# EAGLE design main1 (EAGLE 9.0.1)
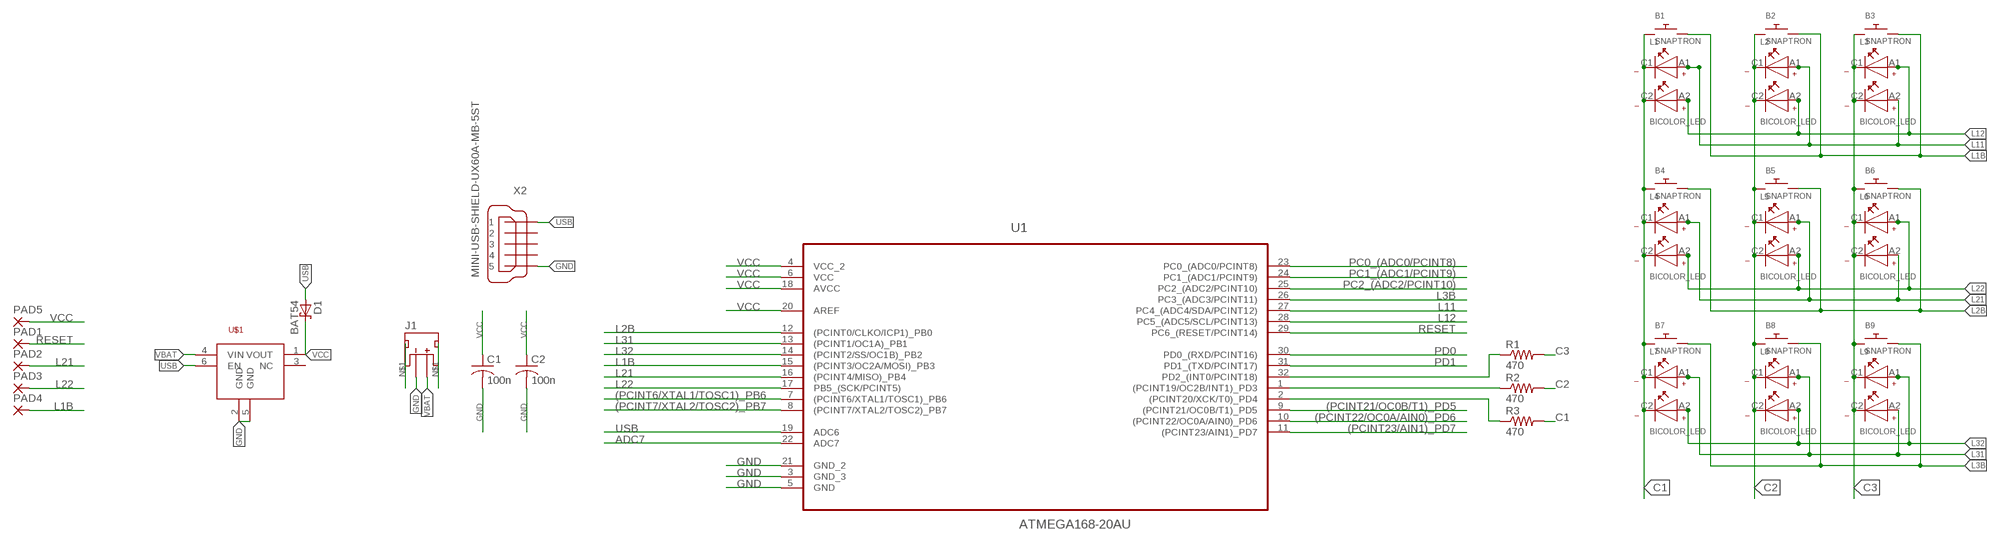
[diagram p0: schematic, sheet 1]

## Parts
B1  SNAPTRON  [SNAPTRON-8.5]
B2  SNAPTRON  [SNAPTRON-8.5]
B3  SNAPTRON  [SNAPTRON-8.5]
B4  SNAPTRON  [SNAPTRON-8.5]
B5  SNAPTRON  [SNAPTRON-8.5]
B6  SNAPTRON  [SNAPTRON-8.5]
B7  SNAPTRON  [SNAPTRON-8.5]
B8  SNAPTRON  [SNAPTRON-8.5]
B9  SNAPTRON  [SNAPTRON-8.5]
C1  100n  C-USC0603  [C0603]
C2  100n  C-USC0603  [C0603]
D1  BAT54  [SOT23]
J1  JST_2MM_MALE  [JST-2-SMD]
L1  BICOLOR_LED  [BICOLOR_LED]
L2  BICOLOR_LED  [BICOLOR_LED]
L3  BICOLOR_LED  [BICOLOR_LED]
L4  BICOLOR_LED  [BICOLOR_LED]
L5  BICOLOR_LED  [BICOLOR_LED]
L6  BICOLOR_LED  [BICOLOR_LED]
L7  BICOLOR_LED  [BICOLOR_LED]
L8  BICOLOR_LED  [BICOLOR_LED]
L9  BICOLOR_LED  [BICOLOR_LED]
PAD1  SMD2  [SMD1,27-2,54]
PAD2  SMD5  [SMD2,54-5,08]
PAD3  SMD5  [SMD2,54-5,08]
PAD4  SMD5  [SMD2,54-5,08]
PAD5  SMD2  [SMD1,27-2,54]
R1  470  R-US_R0603  [R0603]
R2  470  R-US_R0603  [R0603]
R3  470  R-US_R0603  [R0603]
U1  ATMEGA168-20AU  [QFP80P900X900X120-32N]
U$1  MIC94090  [SC70-6L]
X2  MINI-USB-SHIELD-UX60A-MB-5ST  [UX60A-MB-5ST]

## Nets
(PCINT6/XTAL1/TOSC1)_PB6: U1.7((PCINT6/XTAL1/TOSC1)_PB6)
(PCINT7/XTAL2/TOSC2)_PB7: U1.8((PCINT7/XTAL2/TOSC2)_PB7)
(PCINT21/OC0B/T1)_PD5: U1.9((PCINT21/OC0B/T1)_PD5)
(PCINT22/OC0A/AIN0)_PD6: U1.10((PCINT22/OC0A/AIN0)_PD6)
(PCINT23/AIN1)_PD7: U1.11((PCINT23/AIN1)_PD7)
ADC7: U1.22(ADC7)
C1: B1.P$1 B4.P$1 B7.P$1 L1.C1 L1.C2 L4.C1 L4.C2 L7.C1 L7.C2 R3.2
C2: B2.P$1 B5.P$1 B8.P$1 L2.C1 L2.C2 L5.C1 L5.C2 L8.C1 L8.C2 R2.2
C3: B3.P$1 B6.P$1 B9.P$1 L3.C1 L3.C2 L6.C1 L6.C2 L9.C1 L9.C2 R1.2
GND: C1.2 C2.2 J1.1(-) U1.3(GND_3) U1.5(GND) U1.21(GND_2) U$1.2(GND) U$1.5(GND) X2.5
L1B: B1.P$2 B2.P$2 B3.P$2 PAD4.1(P) U1.15((PCINT3/OC2A/MOSI)_PB3)
L2B: B4.P$2 B5.P$2 B6.P$2 U1.12((PCINT0/CLKO/ICP1)_PB0)
L3B: B7.P$2 B8.P$2 B9.P$2 U1.26(PC3_(ADC3/PCINT11))
L11: L1.A1 L2.A1 L3.A2 U1.27(PC4_(ADC4/SDA/PCINT12))
L12: L1.A2 L2.A2 L3.A1 U1.28(PC5_(ADC5/SCL/PCINT13))
L21: L4.A1 L5.A1 L6.A2 PAD2.1(P) U1.16((PCINT4/MISO)_PB4)
L22: L4.A2 L5.A2 L6.A1 PAD3.1(P) U1.17(PB5_(SCK/PCINT5))
L31: L7.A1 L8.A1 L9.A2 U1.13((PCINT1/OC1A)_PB1)
L32: L7.A2 L8.A2 L9.A1 U1.14((PCINT2/SS/OC1B)_PB2)
N$1: J1.NC1(PAD1) J1.NC2(PAD2)
N$2: R2.1 U1.1((PCINT19/OC2B/INT1)_PD3)
N$5: R3.1 U1.2((PCINT20/XCK/T0)_PD4)
N$25: R1.1 U1.32(PD2_(INT0/PCINT18))
PC0_(ADC0/PCINT8): U1.23(PC0_(ADC0/PCINT8))
PC1_(ADC1/PCINT9): U1.24(PC1_(ADC1/PCINT9))
PC2_(ADC2/PCINT10): U1.25(PC2_(ADC2/PCINT10))
PD0: U1.30(PD0_(RXD/PCINT16))
PD1: U1.31(PD1_(TXD/PCINT17))
RESET: PAD1.1(P) U1.29(PC6_(RESET/PCINT14))
USB: D1.1(A) U1.19(ADC6) U$1.6(EN) X2.1
VBAT: J1.2(+) U$1.4(VIN)
VCC: C1.1 C2.1 D1.3(C) PAD5.1(P) U1.4(VCC_2) U1.6(VCC) U1.18(AVCC) U1.20(AREF) U$1.1(VOUT)
Unconnected: U$1.3(NC) X2.2 X2.3 X2.4 X2.M1(S1) X2.M2(S2) X2.M3(S3) X2.M4(S4)

## Library data of the parts
B1-B9 = 7_segment_lib:SNAPTRON
C1 C2 = rcl:C-US: CAPACITOR, American symbol; SPICEPREFIX: C
D1 = diode:BAT54: Schottky Diodes Source: Fairchild .. BAT54.pdf
J1 = SparkFun-Connectors:JST_2MM_MALE: JST 2MM MALE RA CONNECTOR Two pin, compact surface mount connector. Commonly used as a battery input connection point. We really like the solid locking feeling and high current rating on these small connectors. We use these all the time as battery connectors. Mates to single-cell LiPo batteries. Here is the connector we sell at SparkFun: JST Right Angle Connector - White <https://www.sparkfun.com/products/8612> (PRT-08612) Datasheet <http://www.sparkfun.com/datasheets/Prototyping/Connectors/JST-Horizontal.pdf> It was used on these SparkFun products: SparkFun MOSFET Power Controller <https://www.sparkfun.com/products/11214> (PRT-11214) SparkFun Battery Babysitter - LiPo Battery Manager <https://www.sparkfun.com/products/13777> (PRT-13777) And many, many others that required a lipo battery connection.; PROD_ID: CONN-11443; SF_ID: PRT-08612
L1-L9 = 7_segment_lib:BICOLOR_LED
PAD1 PAD5 = wirepad:SMD2: SMD PAD
PAD2-PAD4 = wirepad:SMD5: SMD PAD
R1-R3 = rcl:R-US_: RESISTOR, American symbol; SPICEPREFIX: R
U1 = Atmel_By_element14_Batch_1-00:ATMEGA168-20AU: Microcontroller; DESCRIPTION: Microcontroller; MPN: ATMEGA168-20AU; OC_FARNELL: 9171193; OC_NEWARK: 01M6891; PACKAGE: QFP-32; SUPPLIER: ATMEL
U$1 = 7_segment_lib:MIC94090
X2 = con-hirose:MINI-USB-SHIELD-: MINI USB Connector Source: http://www.hirose.co.jp/cataloge_hp/e24000019.pdf; OC_FARNELL: unknown; OC_NEWARK: unknown

## Board
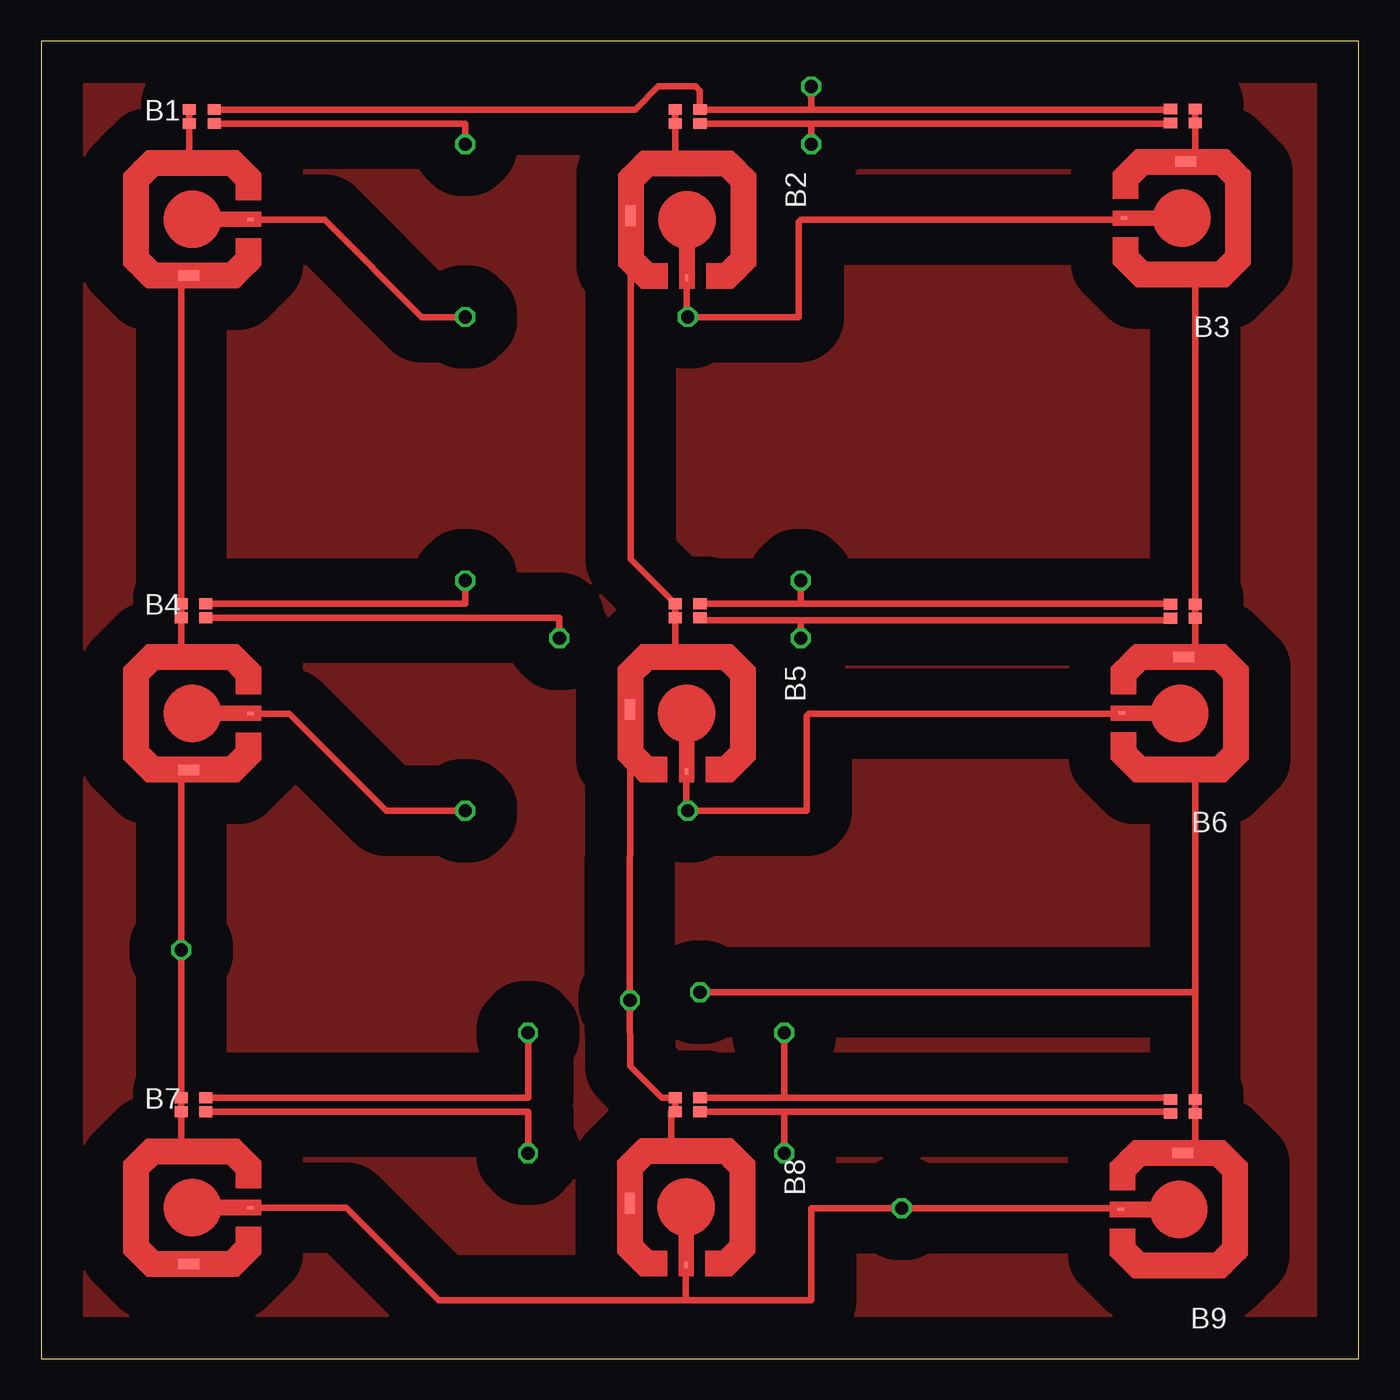
[diagram p1: board, top side]
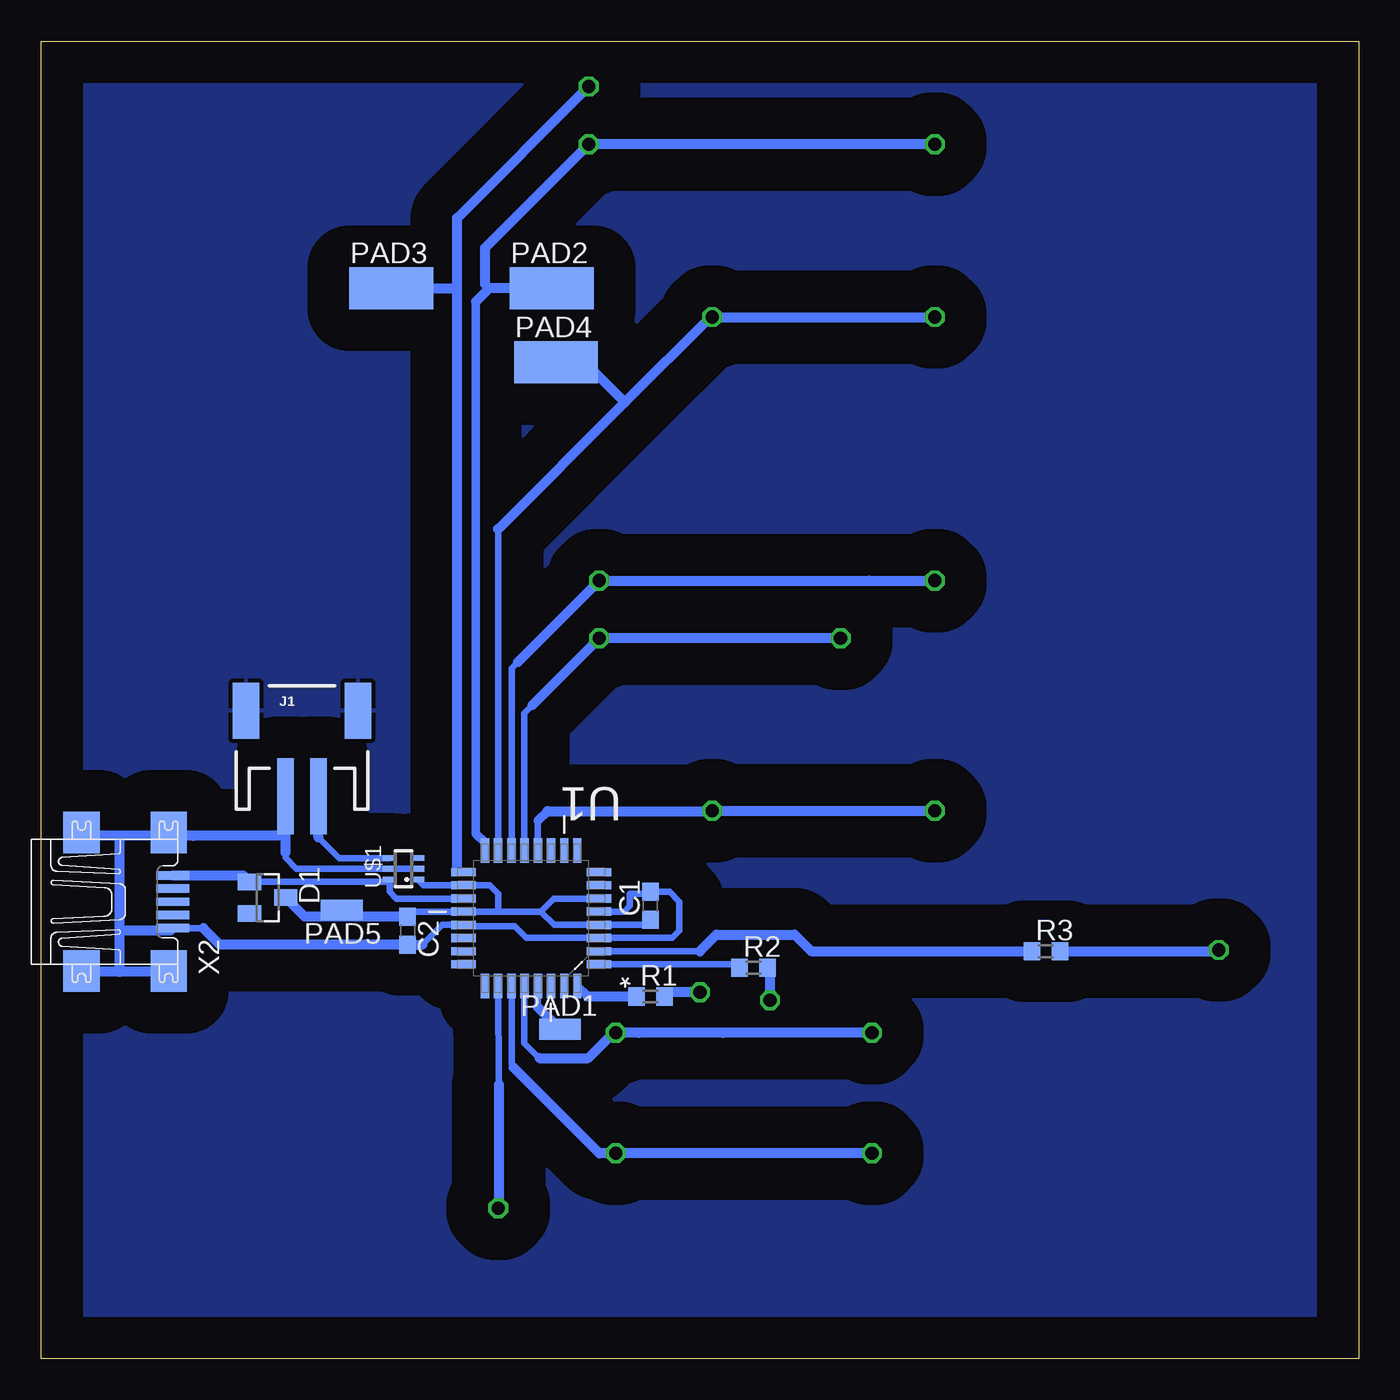
[diagram p2: board, bottom side, seen from below]

Size 80 x 80 mm. Coordinates in mm from the lower left corner, seen from the top.
Outline: 0,0 80,0 80,80 0,80 0,0
Copper layers (1*16): Top 0.035mm / dielectric 1.5mm / Bottom 0.035mm
Design rules "default *": minimum track width 16mil, minimum drill 0.35mm, track to track 6mil, track to pad 6mil, pad to pad 6mil, via to via 6mil, smd to smd 6mil, copper to edge 40mil, drill to drill 6mil, minimum pad ring 10mil, minimum via ring 8mil, stop-mask expansion 4mil, vias tented up to drill 0mil, thermal gap 10mil

### Footprints (pad centres in the part's own frame; a part is rotated, then mirrored left to right if it is on the bottom)
SNAPTRON-8.5 = smd 1.27 x 0.635: P$1 3.95,0.763 | smd 0.406 x 0.203: P$2 7.708,4.171
C0603 = smd 1.1 x 1: 1 -0.85,0; 2 0.85,0
SOT23 = smd 1 x 1.4: 1 -0.95,-1.1; 2 0.95,-1.1; 3 0,1.1
JST-2-SMD = smd 1 x 4.6: 1 -1,-3.7; 2 1,-3.7 | smd 1.6 x 3.4: NC1 -3.4,1.5; NC2 3.4,1.5
BICOLOR_LED = smd 0.8 x 0.65: A1 0,0; A2 0,-0.85; C1 1.5,0; C2 1.5,-0.85
SMD1,27-2,54 = smd 1.27 x 2.54: 1 0,0
SMD2,54-5,08 = smd 2.54 x 5.08: 1 0,0
R0603 = smd 1 x 1.1: 1 -0.85,0; 2 0.85,0
QFP80P900X900X120-32N = smd 1.473 x 0.508: 1 -4.115,2.794; 2 -4.115,2.007; 3 -4.115,1.194; 4 -4.115,0.406; 5 -4.115,-0.406; 6 -4.115,-1.194; 7 -4.115,-2.007; 8 -4.115,-2.794; 17 4.115,-2.794; 18 4.115,-2.007; 19 4.115,-1.194; 20 4.115,-0.406; 21 4.115,0.406; 22 4.115,1.194; 23 4.115,2.007; 24 4.115,2.794 | smd 0.508 x 1.473: 9 -2.794,-4.115; 10 -2.007,-4.115; 11 -1.194,-4.115; 12 -0.406,-4.115; 13 0.406,-4.115; 14 1.194,-4.115; 15 2.007,-4.115; 16 2.794,-4.115; 25 2.794,4.115; 26 2.007,4.115; 27 1.194,4.115; 28 0.406,4.115; 29 -0.406,4.115; 30 -1.194,4.115; 31 -2.007,4.115; 32 -2.794,4.115
SC70-6L = smd 0.35 x 0.8: 1 -0.65,-0.85; 2 0,-0.85; 3 0.65,-0.85; 4 0.65,0.85; 5 0,0.85; 6 -0.65,0.85
UX60A-MB-5ST = smd 2 x 0.5: 1 2.25,1.6; 2 2.25,0.8; 3 2.25,0; 4 2.25,-0.8; 5 2.25,-1.6 | smd 2.2 x 2.5: M1 -3.3,-4.2; M2 -3.3,4.2; M3 2,4.2; M4 2,-4.2

### Placement (x,y rotation side)
B1  5,65 0 top
B2  35.03,73.34 270 top
B3  73.44,73.44 180 top
B4  5,35 0 top
B5  35,43.37 270 top
B6  73.32,43.37 180 top
B7  5,5 0 top
B8  34.97,13.4 270 top
B9  73.25,13.25 180 top
C1  43,27.5 90 bottom
C2  57.75,26 270 bottom
D1  66.25,28 270 bottom
J1  64.16,37.86 0 bottom
L1  10,15 180 top
L2  40,15 180 top
L3  68.57,15.75 0 top
L4  10.5,75 180 top
L5  40,75 180 top
L6  68.57,75.89 0 top
L7  10,45 180 top
L8  40,45 180 top
L9  68.57,45.82 0 top
PAD1  48.5,20 270 bottom
PAD2  49,65 270 bottom
PAD3  58.75,65 270 bottom
PAD4  48.75,60.5 270 bottom
PAD5  61.75,27.25 90 bottom
R1  43,22 0 bottom
R2  36.75,23.75 0 bottom
R3  19,24.75 0 bottom
U1  50.25,26.75 180 bottom
U$1  58,29.75 90 bottom
X2  74.25,27.75 0 bottom

### Tracks (layer width: path | path; a pad name or v marks a point on that pad's centre or on a via)
C1  (via drill 0.8)
  Top 0.406: B7.P$1 7.46,5.76 5.72,7.5 5.72,11.44 6.74,12.45 8.52,12.45 8.52,14.98 L1.C1 L1.C2 v8.5,24.82 | v8.5,24.82 8.5,30.25 v8.5,24.82 | v8.5,24.82 8.5,35.31 | 8.5,35.31 8.5,35.71 8.39,35.82 | L4.C2 L4.C1 9,72.75 8.64,72.4 6.61,72.4 5.85,71.63 5.85,66.94 7.02,65.76 B1.P$1 8.5,65.31 L7.C2 L7.C1 8.52,44.98 8.52,42.55 6.74,42.55 5.85,41.66 5.85,37.09 7.18,35.76 B4.P$1 8.5,35.31 | v8.5,24.82 8.5,35.31
  Bottom 0.406: 8.57,24.75 v8.5,24.82
  Bottom 0.61: R3.2 8.57,24.75
C2  (via drill 0.8)
  Top 0.406: B8.P$1 35.73,11.73 36.75,12.75 38.25,12.75 38.25,15 L2.C1 L2.C2 37.68,15.85 35.76,17.77 v35.75,21.76 35.76,39.25 | 35.76,39.25 B5.P$1 | 35.76,39.25 35.76,41.76 36.75,42.75 38.25,42.75 38.5,43 L8.C1 L8.C2 35.79,48.56 35.79,69.25 | 35.79,69.25 B2.P$1 | L5.C2 L5.C1 38.5,73 38.25,72.75 37.25,72.75 35.75,71.25 35.75,69.29 35.79,69.25
  Bottom 0.406: R2.2 35.75,23.6
  Bottom 0.61: 35.75,23.6 v35.75,21.76
C3  (via drill 0.8)
  Top 0.406: B9.P$1 70.07,13.26 L3.C2 L3.C1 70.07,18.25 70.07,22.25 | L6.C1 L6.C2 70.07,73.26 B3.P$1 69.59,72.78 71.38,72.78 72.65,71.51 72.65,67.19 71.38,65.92 70.49,65.92 70.07,65.5 L9.C1 L9.C2 70.07,43.31 B6.P$1 69.44,42.68 71.38,42.68 71.38,42.17 72.52,41.03 72.52,36.84 71.51,35.82 70.36,35.82 70.07,35.53 70.07,22.25 | 70.07,22.25 v40,22.25
  Bottom 0.406: 41.9,22.25 R1.2
  Bottom 0.61: v40,22.25 41.9,22.25
GND
  Bottom 0.406: U1.5 44.59,27.16 44.25,27.5 44.25,28.25 43.1,28.25 C1.2 41.85,28.35 41.25,27.75 41.25,26 41.69,25.56 U1.3 50.56,25.56 51.25,26.25 54.27,26.25 U1.21 55.66,26.34 56.85,25.15 | U$1.2 U$1.5 64.5,29.75 65.16,30.41 65.16,30.75 | 65.16,31.75 J1.1 | 70.15,26.15 X2.5 72.15,26 | 75.25,26 75.25,31.75
  Bottom 0.61: 56.85,25.15 C2.2 69.15,25.15 70.15,26.15 | 65.16,30.75 65.16,31.75 70.75,31.75 75.25,31.75 | 75.25,31.75 77.5,31.75 | 72.25,23.5 75.25,23.5 | 75.25,23.5 77.75,23.5 | 75.25,31.75 75.25,23.5 | 72.15,26 75.25,26
  pour Top (isolate 2.54): 0.25,0.25 80.25,0.25 80.25,80.25 0.25,80.25
L1B  (via drill 0.8)
  Top 0.406: B1.P$2 17.2,69.17 23.12,63.25 v25.75,63.25 | B3.P$2 65.63,69.17 63.33,69.17 46.11,69.17 45.98,69.04 45.98,63.25 v39.25,63.25 39.2,63.3 B2.P$2
  Bottom 0.406: 39.38,63.25 v39.25,63.25 | U1.15 52.26,50.37
  Bottom 0.61: v39.25,63.25 v25.75,63.25 | 52.26,50.37 44.56,58.06 | 44.56,58.06 39.38,63.25 | PAD4.1 47,60.5 44.56,58.06
L2B  (via drill 0.8)
  Top 0.406: B4.P$2 15.07,39.17 20.96,33.28 v25.75,33.28 | B6.P$2 65.58,39.17 46.62,39.17 46.49,39.04 46.49,33.28 v39.25,33.28 39.17,33.36 B5.P$2
  Bottom 0.406: U1.12 49.84,32.66 | 39.28,33.25 v39.25,33.28
  Bottom 0.508: 49.84,32.66 49.25,33.25
  Bottom 0.61: v39.25,33.28 v25.75,33.28 | 49.25,33.25 39.28,33.25
L3B  (via drill 0.8)
  Top 0.406: B7.P$2 18.25,9.17 18.53,9.17 24.14,3.56 39.12,3.56 | 39.12,3.56 46.74,3.56 46.74,9.15 49.25,9.15 v52.25,9.15 64.52,9.15 | 64.27,9.15 64.52,9.15 | 64.52,9.15 64.65,9.15 65.48,9.15 B9.P$2 | B8.P$2 39.14,3.58 39.12,3.56
  Bottom 0.406: U1.26 52.2,16.64 | 52.2,9.26 52.25,9.25 v52.25,9.15
  Bottom 0.61: 52.2,16.64 52.2,9.26
L11  (via drill 0.8)
  Top 0.406: L1.A1 22.25,15 29.56,15 v29.56,12.48 | L3.A2 68.57,14.99 45.12,14.99 | 45.12,14.99 40.25,14.99 40.25,15 L2.A1 | v45.12,12.48 45.12,14.99
  Bottom 0.406: 51.32,17.68 51.32,17.79 51.44,17.91 U1.27
  Bottom 0.61: v29.56,12.48 v45.12,12.48 46.12,12.48 51.32,17.68
L12  (via drill 0.8)
  Top 0.406: L1.A2 29.56,15.85 v29.56,19.79 | L3.A1 68.57,15.85 45.12,15.85 | L2.A2 45.12,15.85 | v45.12,19.79 45.12,15.85
  Bottom 0.406: v29.56,19.79 29.73,19.79 | 45.25,19.79 v45.12,19.79 | U1.28 50.66,20.66 50.66,19.16 49.75,18.25
  Bottom 0.61: 29.73,19.79 38.62,19.79 43.7,19.79 45.25,19.79 46.79,18.25 49.75,18.25
L21  (via drill 0.8)
  Top 0.406: L4.A1 25.75,75 v25.75,73.75 | L6.A2 68.53,75 46.75,75 | L5.A1 46.75,75 | v46.75,73.75 46.75,75
  Bottom 0.406: 48.64,71.86 48.5,72 | 52.79,65 53.04,65.25
  Bottom 0.508: U1.16 53.04,31.33 53.6,31.88 53.6,64.19
  Bottom 0.61: v25.75,73.75 v46.75,73.75 48.5,72 53.04,67.46 53.04,65.25 | PAD2.1 52.79,65 53.6,64.19
L22  (via drill 0.8)
  Top 0.406: L4.A2 36.08,75.85 37.48,77.25 39.75,77.25 40,77 L5.A2 46.75,75.85 | L6.A1 68.53,75.85 46.75,75.85 | 46.75,75.85 v46.75,77.25
  Bottom 0.406: U1.17 54.75,29.93 | 55,65 54.75,65.25
  Bottom 0.61: v46.75,77.25 54.75,69.25 54.75,65.25 54.75,29.93 | PAD3.1 55,65
L31  (via drill 0.8)
  Top 0.406: L7.A1 31.46,45 v31.46,43.75 | L8.A1 40,44.84 46.12,44.84 | L9.A2 68.57,44.84 46.12,44.84 | v46.12,43.75 46.12,44.84
  Bottom 0.406: U1.13 50.66,39.21 50.17,39.69
  Bottom 0.61: v31.46,43.75 41.16,43.75 v46.12,43.75 50.17,39.69
L32  (via drill 0.8)
  Top 0.406: L7.A2 25.75,45.85 v25.75,47.25 | L9.A1 68.57,45.85 46.12,45.85 | L8.A2 46.12,45.85 | 46.12,45.85 v46.12,47.25
  Bottom 0.406: U1.14 51.44,41.92 51.07,42.3 51.06,42.3
  Bottom 0.61: v25.75,47.25 29.73,47.25 v46.12,47.25 51.06,42.3
N$1
  pour Bottom (isolate 2.54): -0.76,-0.76 80.53,-0.76 80.53,80.53 -0.76,80.53
N$2
  Bottom 0.406: U1.1 37.81,23.96 R2.1
N$5
  Bottom 0.406: U1.2 40.01,24.74
  Bottom 0.61: 40.01,24.74 39,25.75 34.25,25.75 33.25,24.75 R3.1
N$25
  Bottom 0.508: U1.32 46.82,22
  Bottom 0.61: 46.82,22 R1.1
RESET
  Bottom 0.406: U1.29 49.84,21.34
  Bottom 0.61: 49.84,21.34 PAD1.1
USB
  Bottom 0.406: U1.19 58.44,27.94 58.85,28.35 U$1.6 59,28.95 D1.1
  Bottom 0.61: X2.1 67.75,29.35 D1.1
VBAT
  Bottom 0.406: U$1.4 61.9,30.4 63.16,31.66
  Bottom 0.61: 63.16,31.66 J1.2
VCC
  Bottom 0.406: 49.66,27.16 52.25,27.16 | 52.25,27.16 U1.20 57.44,27.16 C2.1 | 49.66,27.16 48.84,26.34 U1.4 43.06,26.34 C1.1 | U1.6 48.87,27.94 49.66,27.16 | 52.25,27.16 52.25,28.25 52.76,28.76 U1.18 56.81,28.76 U$1.1 | PAD5.1 61.75,26.85
  Bottom 0.61: C2.1 61.75,26.85 64,26.85 D1.3